# Altium schematic sheet IO.SchDoc
size A4
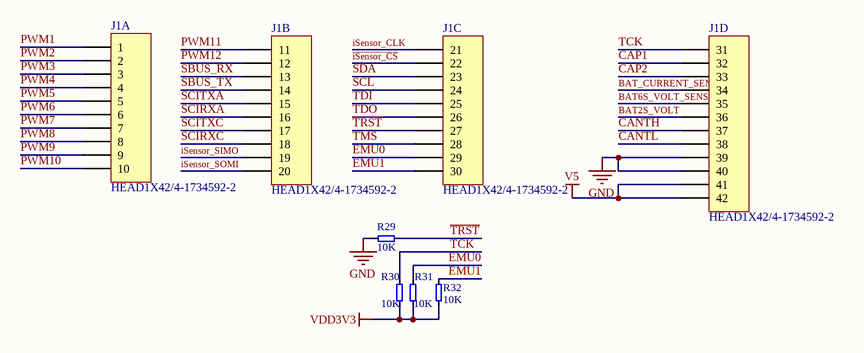
[diagram p0: IO.SchDoc]

## Parts
J1  HEAD1X42/4-1734592-2  [FPC0.5-42]  (parts A,B,C,D of 4)
R29  10K  [0603R]
R30  10K  [0603R]
R31  10K  [0603R]
R32  10K  [0603R]

## Nets
GND: J1.39 J1.40 R29.1
V5: J1.40(41)
VDD3V3: R30.1 R31.1 R32.1
BAT2S_VOLT: J1.36
BAT6S_VOLT_SENSE: J1.35
BAT_CURRENT_SENSE: J1.34
CANTH: J1.37
CANTL: J1.38
CAP1: J1.32
CAP2: J1.33
EMU0: J1.29 R31.2
EMU1: J1.30 R32.2
~{iSensor_CS}: J1.22
iSensor_CLK: J1.21
iSensor_SIMO: J1.19
iSensor_SOMI: J1.20
PWM1: J1.1
PWM2: J1.2
PWM3: J1.3
PWM4: J1.4
PWM5: J1.5
PWM6: J1.6
PWM7: J1.7
PWM8: J1.8
PWM9: J1.9
PWM10: J1.10
PWM11: J1.11
PWM12: J1.12
SBUS_RX: J1.13
SBUS_TX: J1.14
SCIRXA: J1.16
SCIRXC: J1.18
SCITXA: J1.15
SCITXC: J1.17
SCL: J1.24
SDA: J1.23
~{TRST}: J1.27 R29.2
TCK: J1.31 R30.2
TDI: J1.25
TDO: J1.26
TMS: J1.28

## Library data of the parts
J1 = HEAD1X42
R29-R32 = R